# Altium schematic sheet Micro.SchDoc
size A4
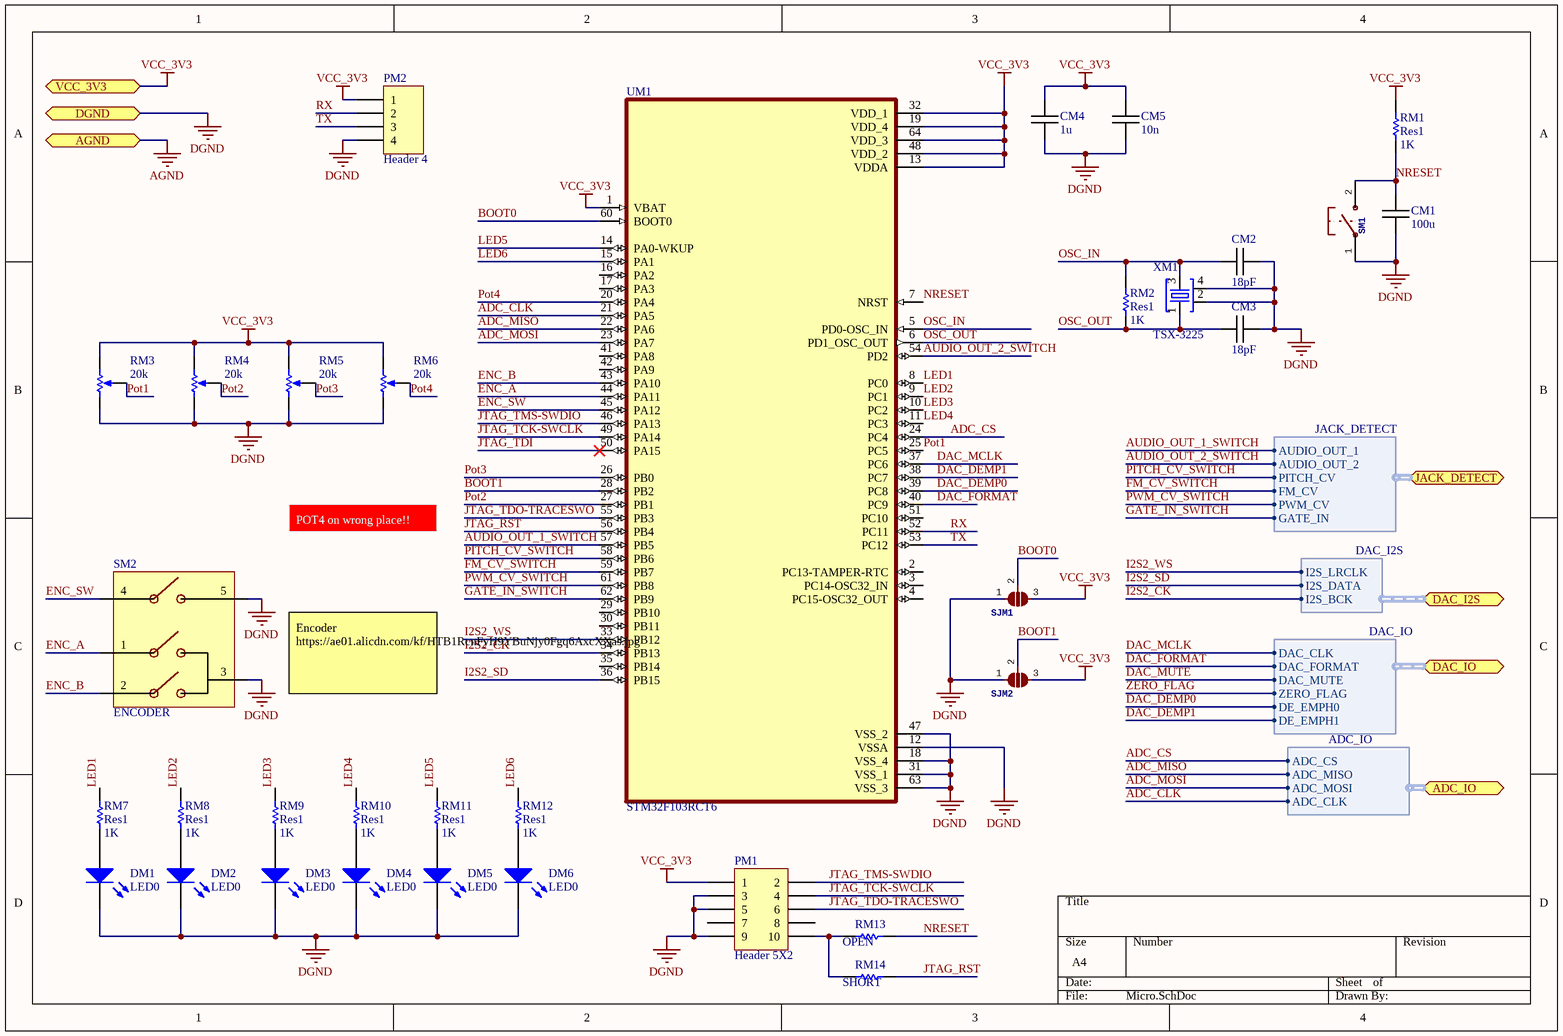
[diagram p0: Micro.SchDoc]

## Parts
CM1  100u  [C 0603 / 1608]
CM2  18pF  [C 0603 / 1608]
CM3  18pF  [C 0603 / 1608]
CM4  1u  [C 0603 / 1608]
CM5  10n  [C 0603 / 1608]
DM1  LED0  [LED2-2.54-D5.0MM]
DM2  LED0  [LED2-2.54-D5.0MM]
DM3  LED0  [LED2-2.54-D5.0MM]
DM4  LED0  [LED2-2.54-D5.0MM]
DM5  LED0  [LED2-2.54-D5.0MM]
DM6  LED0  [LED2-2.54-D5.0MM]
PM1  Header 5X2  [HDR2X5]
PM2  Header 4  [HDR1X4]
RM1  Res1  value 1K  [RES0603R]
RM2  Res1  value 1K  [RES0603R]
RM3  value 20k  [POT-rv09]
RM4  value 20k  [POT-rv09]
RM5  value 20k  [POT-rv09]
RM6  value 20k  [POT-rv09]
RM7  Res1  value 1K  [RES0603R]
RM8  Res1  value 1K  [RES0603R]
RM9  Res1  value 1K  [RES0603R]
RM10  Res1  value 1K  [RES0603R]
RM11  Res1  value 1K  [RES0603R]
RM12  Res1  value 1K  [RES0603R]
RM13  value OPEN  [RES0603R]  (hidden comment: Res1)
RM14  value SHORT  [RES0603R]  (hidden comment: Res1)
SJM1  2-Way Solder Jumper  [SOLDERJUMPER_2WAY_OPEN_NOPASTE]  (value not drawn)
SJM2  2-Way Solder Jumper  [SOLDERJUMPER_2WAY_OPEN_NOPASTE]  (value not drawn)
SM1  Switch  [PUSH_SMD_3x4]  (value not drawn)
SM2  ENCODER  [Rotary Encoder]
UM1  STM32F103RCT6  [QFP64P1200X1200X160-64N]
XM1  TSX-3225  [TSX-3225]

## Ports
ADC_IO (bidir, harness ADC_IO), AGND (bidir), DAC_I2S (bidir, harness DAC_I2S), DAC_IO (bidir, harness DAC_IO), DGND (bidir), JACK_DETECT (bidir, harness JACK_DETECT), VCC_3V3 (bidir)

## Harnesses
DAC_I2S: I2S_LRCLK, I2S_DATA, I2S_BCK
DAC_IO: DAC_CLK, DAC_FORMAT, DAC_MUTE, ZERO_FLAG, DE_EMPH0, DE_EMPH1
JACK_DETECT: AUDIO_OUT_1, AUDIO_OUT_2, PITCH_CV, FM_CV, PWM_CV, GATE_IN
ADC_IO: ADC_CS, ADC_MISO, ADC_MOSI, ADC_CLK

## Nets
AGND: port AGND
DGND: CM1.1 CM2.1 CM3.1 CM4.1 CM5.1 DM1.2(K) DM2.2(K) DM3.2(K) DM4.2(K) DM5.2(K) DM6.2(K) PM1.3 PM1.5 PM1.9 PM2.4 RM3.1(TOP) RM4.1(TOP) RM5.1(TOP) RM6.1(TOP) SJM1.1 SJM2.1 SM1.1(P$1) SM2.3(ROT_COMMON) SM2.5(SW_GND) UM1.12(VSSA) UM1.18(VSS_4) UM1.31(VSS_1) UM1.47(VSS_2) UM1.63(VSS_3) XM1.2 XM1.4 ; port DGND
VCC_3V3: CM4.2 CM5.2 PM1.1 PM2.1 RM1.1 RM3.2(BOT) RM4.2(BOT) RM5.2(BOT) RM6.2(BOT) SJM1.3 SJM2.3 UM1.1(VBAT) UM1.13(VDDA) UM1.19(VDD_4) UM1.32(VDD_1) UM1.48(VDD_2) UM1.64(VDD_3) ; port VCC_3V3
ADC_CLK: UM1.21(PA5) ; port ADC_IO.ADC_CLK
ADC_CS: UM1.24(PC4) ; port ADC_IO.ADC_CS
ADC_MISO: UM1.22(PA6) ; port ADC_IO.ADC_MISO
ADC_MOSI: UM1.23(PA7) ; port ADC_IO.ADC_MOSI
AUDIO_OUT_1_SWITCH: UM1.57(PB5) ; port JACK_DETECT.AUDIO_OUT_1
AUDIO_OUT_2_SWITCH: UM1.54(PD2) ; port JACK_DETECT.AUDIO_OUT_2
BOOT0: SJM1.2 UM1.60(BOOT0)
BOOT1: SJM2.2 UM1.28(PB2)
DAC_DEMP0: UM1.39(PC8) ; port DAC_IO.DE_EMPH0
DAC_DEMP1: UM1.38(PC7) ; port DAC_IO.DE_EMPH1
DAC_FORMAT: UM1.40(PC9) ; port DAC_IO.DAC_FORMAT
DAC_MCLK: UM1.37(PC6) ; port DAC_IO.DAC_CLK
DAC_MUTE: port DAC_IO.DAC_MUTE
ENC_A: SM2.1 UM1.44(PA11)
ENC_B: SM2.2 UM1.43(PA10)
ENC_SW: SM2.4(SW) UM1.45(PA12)
FM_CV_SWITCH: UM1.59(PB7) ; port JACK_DETECT.FM_CV
GATE_IN_SWITCH: UM1.62(PB9) ; port JACK_DETECT.GATE_IN
I2S2_CK: UM1.34(PB13) ; port DAC_I2S.I2S_BCK
I2S2_SD: UM1.36(PB15) ; port DAC_I2S.I2S_DATA
I2S2_WS: UM1.33(PB12) ; port DAC_I2S.I2S_LRCLK
JTAG_RST: RM14.2 UM1.56(PB4)
JTAG_TCK-SWCLK: PM1.4 UM1.49(PA14)
JTAG_TDI: UM1.50(PA15)
JTAG_TDO-TRACESWO: PM1.6 UM1.55(PB3)
JTAG_TMS-SWDIO: PM1.2 UM1.46(PA13)
LED1: RM7.1 UM1.8(PC0)
LED2: RM8.1 UM1.9(PC1)
LED3: RM9.1 UM1.10(PC2)
LED4: RM10.1 UM1.11(PC3)
LED5: RM11.1 UM1.14(PA0-WKUP)
LED6: RM12.1 UM1.15(PA1)
NRESET: CM1.2 RM1.2 RM13.2 SM1.2(P$2) UM1.7(NRST)
OSC_IN: CM2.2 RM2.1 UM1.5(PD0-OSC_IN) XM1.3
OSC_OUT: CM3.2 RM2.2 UM1.6(PD1_OSC_OUT) XM1.1
PITCH_CV_SWITCH: UM1.58(PB6) ; port JACK_DETECT.PITCH_CV
Pot1: RM3.3(TAP) UM1.25(PC5)
Pot2: RM4.3(TAP) UM1.27(PB1)
Pot3: RM5.3(TAP) UM1.26(PB0)
Pot4: RM6.3(TAP) UM1.20(PA4)
PWM_CV_SWITCH: UM1.61(PB8) ; port JACK_DETECT.PWM_CV
RX: PM2.2 UM1.52(PC11)
TX: PM2.3 UM1.53(PC12)
ZERO_FLAG: port DAC_IO.ZERO_FLAG
NetDM1_1: DM1.1(A) RM7.2
NetDM2_1: DM2.1(A) RM8.2
NetDM3_1: DM3.1(A) RM9.2
NetDM4_1: DM4.1(A) RM10.2
NetDM5_1: DM5.1(A) RM11.2
NetDM6_1: DM6.1(A) RM12.2
NetPM1_10: PM1.10 RM13.1 RM14.1

Not connected (* = marked no-connect by the designer): PM1 7 8; UM1 2(PC13-TAMPER-RTC) 3(PC14-OSC32_IN) 4(PC15-OSC32_OUT) 16(PA2) 17(PA3) 29(PB10) 30(PB11) 35(PB14) 41(PA8) 42(PA9) 51(PC10)

## Notes on the sheet
- POT4 on wrong place!!
- Encoder
  https://ae01.alicdn.com/kf/HTB1RcnFyH9YBuNjy0Fgq6AxcXXas.jpg

## Library data of the parts
CM1 CM4 CM5 = Capacitor
  CM1: Value: 100u
  CM4: Value: 1u
  CM5: Value: 10n
CM2 CM3 = Capacitor: Value: 18p
DM1-DM6 = LED0: Typical INFRARED GaAs LED; Published: 8-Jun-2000; LatestRevisionDate: 08-Jul-2005; LatestRevisionNote: Mech Layer 1 removed.; PackageReference: LED-0; Publisher: Altium Limited; PackageDescription: LED; 2 Leads
PM1 = Header 5X2: Header, 5-Pin, Dual row; LatestRevisionDate: 17-Jul-2002; LatestRevisionNote: Re-released for DXP Platform.; Publisher: Altium Limited
PM2 = Header 4: Header, 4-Pin; LatestRevisionDate: 17-Jul-2002; LatestRevisionNote: Re-released for DXP Platform.; Publisher: Altium Limited
RM1 RM2 RM7-RM14 = Res1: Resistor; Published: 8-Jun-2000; LatestRevisionDate: 17-Jul-2002; LatestRevisionNote: Re-released for DXP Platform.; PackageReference: AXIAL-0.3; Publisher: Altium Limited; PackageDescription: Axial Device, Thru-Hole; 2 Leads; 0.3 in Pin Spacing
RM3-RM6 = RPot: Potentiometer; Sim Note: Enter the Resistance value and the set point into parameter fields.; Set Position: 0.5; Published: 8-Jun-2000; LatestRevisionDate: 17-Jul-2002; LatestRevisionNote: Re-released for DXP Platform.; PackageReference: VR5; Publisher: Altium Limited; PackageDescription: Variable Resistor, Thru-Hole; 3 Leads
SJM1 SJM2 = SOLDERJUMPER_2WAY0603
SM1 = B3U-1000P: MANUFACTURER: Omron; DIGIKEY: SW1020CT-ND; MPN: B3U-1000P
UM1 = STM32F103RCT6: ARMÂ® CortexÂ®-M3 STM32F1 Microcontroller IC 32-Bit 72MHz 256KB _256K x 8_ FLASH; MF: STMicroelectronics; MP: STM32F103RCT6; Price: None; Package: LQFP-64 STMicroelectronics; Availability: Unavailable; SnapEDA_Link: https://www.snapeda.com/parts/STM32F103RCT6/STMicroelectronics/view-part/44152/?ref=snap; Value: *
XM1 = TSX-3225: 16MHz Â±10ppm Crystal 9pF 60 Ohms 4-SMD, No Lead; MF: EPSON; Package: SMD-4 Epson; Price: None; SnapEDA_Link: https://www.snapeda.com/parts/TSX-3225/EPSON/view-part/557780/?ref=snap; Availability: Unavailable; Value: *; MP: TSX-3225